# EAGLE design cpld_demo_board (EAGLE 5.07)
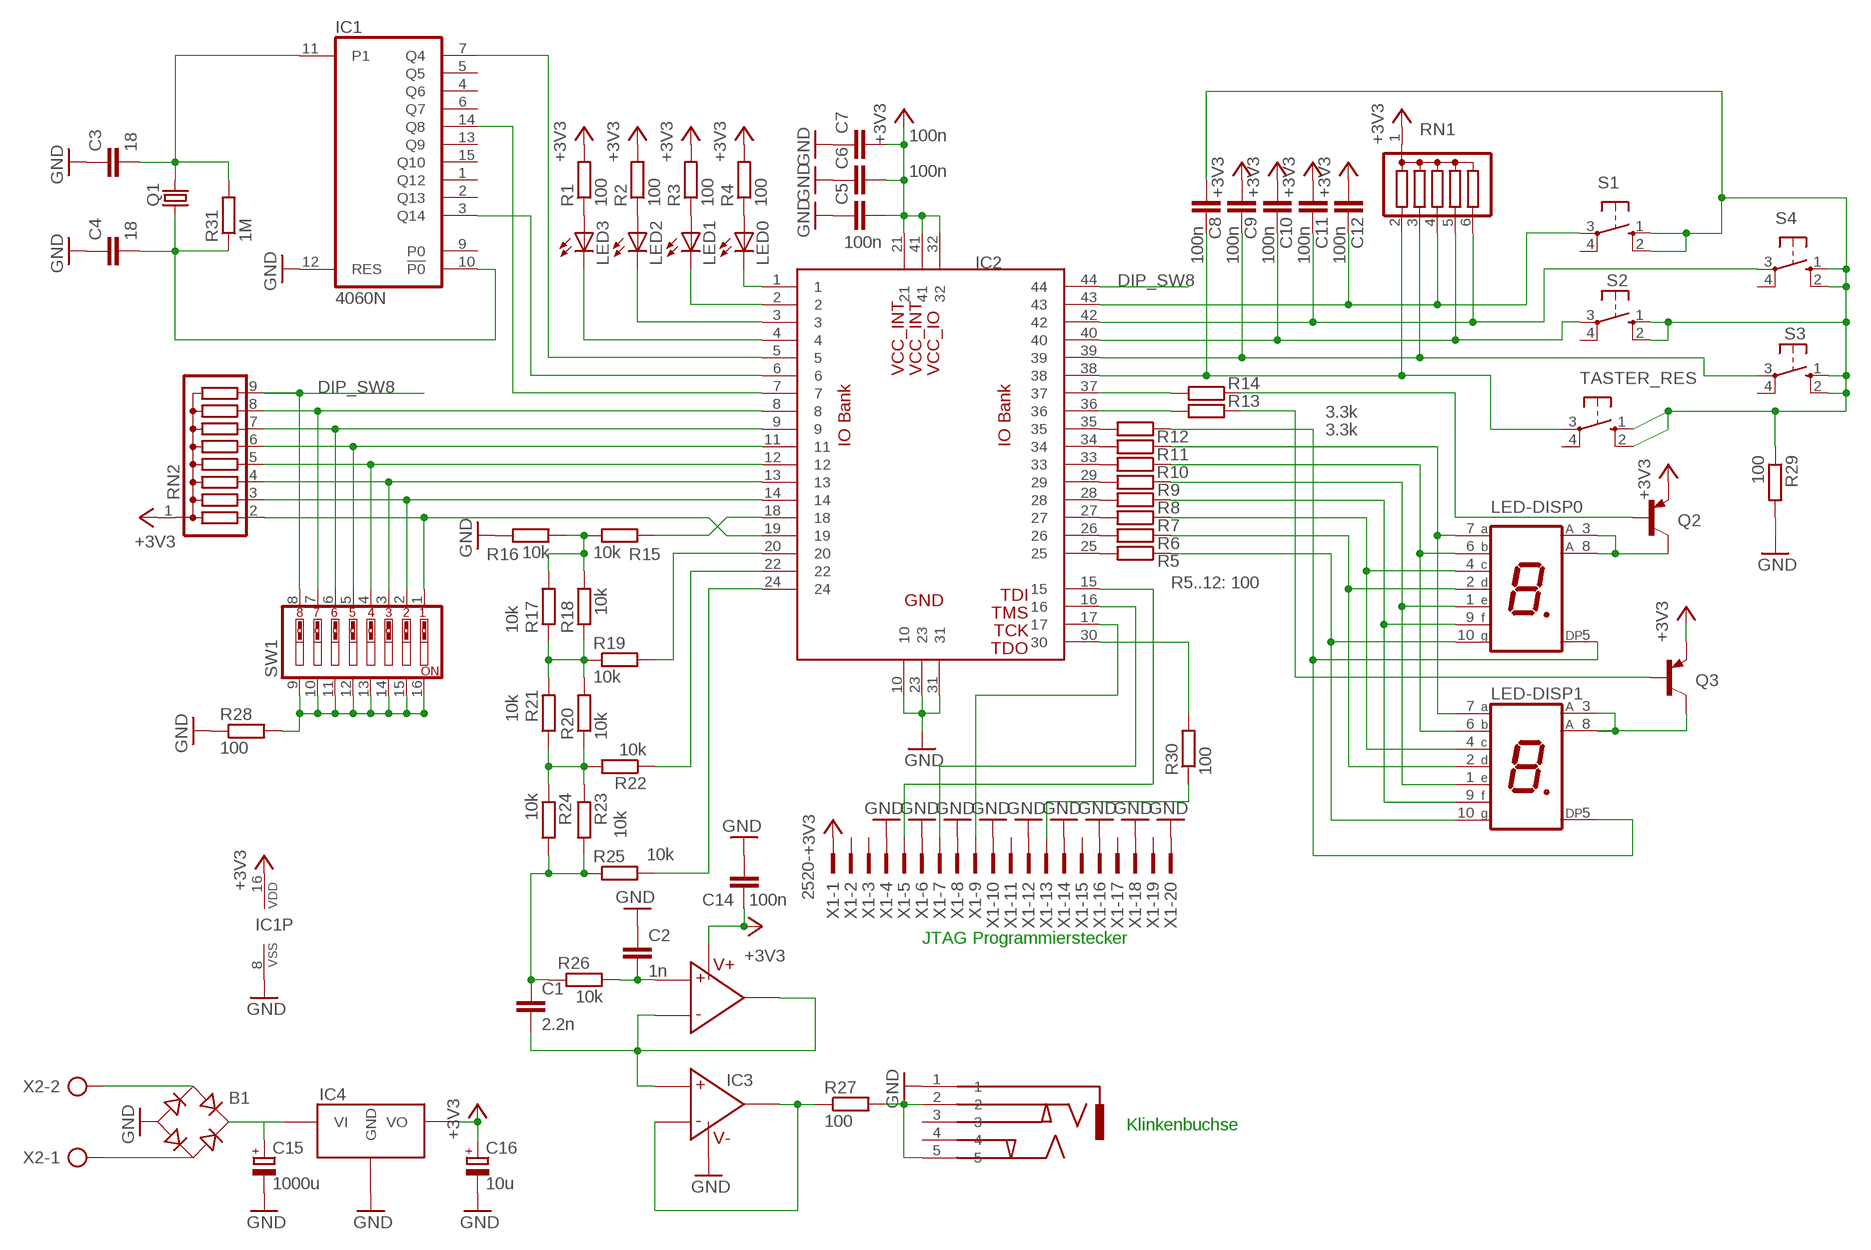
[diagram p0: schematic, sheet 1]

## Parts
B1  RB1A  [RB1A]
C1  2.2n  C2,5-3  [C2.5-3]
C2  1n  C2,5-3  [C2.5-3]
C3  18  C-EU025-024X044  [C025-024X044]
C4  18  C-EU025-024X044  [C025-024X044]
C5  100n  C-EU025-025X050  [C025-025X050]
C6  100n  C-EU025-025X050  [C025-025X050]
C7  100n  C-EU025-025X050  [C025-025X050]
C8  100n  C-EU025-025X050  [C025-025X050]
C9  100n  C-EU025-025X050  [C025-025X050]
C10  100n  C-EU025-025X050  [C025-025X050]
C11  100n  C-EU025-025X050  [C025-025X050]
C12  100n  C-EU025-025X050  [C025-025X050]
C14  100n  C-EU025-025X050  [C025-025X050]
C15  1000u  CPOL-EUE5-10.5  [E5-10,5]
C16  10u  CPOL-EUE2-5  [E2-5]
IC1  4060N  [DIL16]
IC2  XC9572XL  [PLCC44]
IC3  TS912  [DIP8]
IC4  LM2937ET-3.3  [TO220]
LED0  LED3MM  [LED3MM]
LED1  LED3MM  [LED3MM]
LED2  LED3MM  [LED3MM]
LED3  LED3MM  [LED3MM]
LED-DISP0  7-SEG_SA56-11  [SA56-11]
LED-DISP1  7-SEG_SA56-11  [SA56-11]
Q1  CRYSTALHC49U-V  [HC49U-V]
Q2  BC327PINS-IN-LINE  [TO92-]
Q3  BC327  BC327PINS-IN-LINE  [TO92-]
R1  100  R-EU_0207/10  [0207/10]
R2  100  R-EU_0207/10  [0207/10]
R3  100  R-EU_0207/10  [0207/10]
R4  100  R-EU_0207/10  [0207/10]
R5  R-EU_0207/10  [0207/10]
R6  R-EU_0207/10  [0207/10]
R7  R-EU_0207/10  [0207/10]
R8  R-EU_0207/10  [0207/10]
R9  R-EU_0207/10  [0207/10]
R10  R-EU_0207/10  [0207/10]
R11  R-EU_0207/10  [0207/10]
R12  R-EU_0207/10  [0207/10]
R13  3.3k  R-EU_0207/10  [0207/10]
R14  3.3k  R-EU_0207/10  [0207/10]
R15  10k  R-EU_0207/10  [0207/10]
R16  10k  R-EU_0207/10  [0207/10]
R17  10k  R-EU_0207/10  [0207/10]
R18  10k  R-EU_0207/10  [0207/10]
R19  10k  R-EU_0207/10  [0207/10]
R20  10k  R-EU_0207/10  [0207/10]
R21  10k  R-EU_0207/10  [0207/10]
R22  10k  R-EU_0207/10  [0207/10]
R23  10k  R-EU_0207/10  [0207/10]
R24  10k  R-EU_0207/10  [0207/10]
R25  10k  R-EU_0207/10  [0207/10]
R26  10k  R-EU_0207/10  [0207/10]
R27  100  R-EU_0207/10  [0207/10]
R28  100  R-EU_0207/10  [0207/10]
R29  100  R-EU_0207/10  [0207/10]
R30  100  R-EU_0207/10  [0207/10]
R31  1M  R-EU_0207/10  [0207/10]
RN1  G05R  [SIL6]
RN2  G08R  [SIL9]
S1  10-XX  [B3F-10XX]
S2  10-XX  [B3F-10XX]
S3  10-XX  [B3F-10XX]
S4  10-XX  [B3F-10XX]
SW1  SW_DIP-8  [EDG-08]
TASTER_RES  10-XX  [B3F-10XX]
X1  2520-  [PAK100/2500-20]
X2  AK500/2-H  [AK500/2-H]
X3  KLINKENBUCHSE  [KLINKENBUCHSE]

## Nets
+3V3: C5.2 C6.2 C9.2 C10.2 C11.2 C12.2 C14.1 C16.+ IC1.16(VDD) IC2.21 IC2.32 IC2.41 IC3.P$8 IC4.P$3(VO) Q2.1(E) Q3.1(E) R1.2 R2.2 R3.2 R4.2 RN1.1 RN2.1 X1.1
DIP_SW8: IC2.44 RN2.9 SW1.8
GND: B1.- C2.1 C3.1 C4.1 C5.1 C6.1 C7.1 C14.2 C15.- C16.- IC1.8(VSS) IC1.12(RES) IC2.10 IC2.23 IC2.31 IC3.P$4 IC4.P$2(GND) R16.1 R28.1 R29.2 X1.4 X1.6 X1.8 X1.10 X1.12 X1.14 X1.16 X1.18 X1.20 X3.1
N$1: LED3.A R1.1
N$2: LED2.A R2.1
N$3: LED1.A R3.1
N$4: LED0.A R4.1
N$5: IC2.25 R5.2
N$6: IC2.26 R6.2
N$7: IC2.27 R7.2
N$8: IC2.28 R8.2
N$9: IC2.29 R9.2
N$10: IC2.33 R10.2
N$11: IC2.34 R11.2
N$12: IC2.35 R12.2
N$13: LED-DISP1.3(A) LED-DISP1.8(A) Q3.3(C)
N$14: IC2.1 LED0.K(C)
N$15: IC2.2 LED1.K(C)
N$16: IC2.3 LED2.K(C)
N$17: IC2.4 LED3.K(C)
N$18: IC1.7(Q4) IC2.5
N$19: IC1.3(Q14) IC2.6
N$20: IC1.14(Q8) IC2.7
N$21: C4.2 IC1.10(!P0) Q1.1 R31.1
N$22: C3.2 IC1.11(P1) Q1.2 R31.2
N$23: IC2.18 R15.2
N$24: IC2.20 R19.2
N$25: IC2.22 R22.1
N$26: IC2.24 R25.2
N$27: R15.1 R16.2 R17.2 R18.2
N$28: IC2.14 RN2.3 SW1.2
N$29: R17.1 R18.1 R19.1 R20.2 R21.2
N$30: IC2.13 RN2.4 SW1.3
N$31: R20.1 R21.1 R22.2 R23.1 R24.1
N$32: C1.1 R23.2 R24.2 R25.1 R26.1
N$33: IC2.12 RN2.5 SW1.4
N$34: IC2.11 RN2.6 SW1.5
N$35: C2.2 IC3.P$3 R26.2
N$36: C1.2 IC3.P$1 IC3.P$2 IC3.P$5
N$37: IC3.P$6 IC3.P$7 R27.1
N$38: B1.AC1 X2.2
N$39: B1.AC2 X2.1
N$40: B1.+ C15.+ IC4.P$1(VI)
N$41: LED-DISP0.3(A) LED-DISP0.8(A) Q2.3(C)
N$42: LED-DISP0.7(A) LED-DISP1.7(A) R11.1
N$43: R28.2 SW1.9 SW1.10 SW1.11 SW1.12 SW1.13 SW1.14 SW1.15 SW1.16
N$44: IC2.19 RN2.2 SW1.1
N$45: IC2.9 RN2.7 SW1.6
N$46: IC2.8 RN2.8 SW1.7
N$47: IC2.17 X1.9
N$48: IC2.16 X1.7
N$49: IC2.15 X1.5
N$50: IC2.30 R30.2
N$51: R30.1 X1.13
N$52: R27.2 X3.2 X3.5
N$53: LED-DISP0.6(B) LED-DISP1.6(B) R10.1
N$54: LED-DISP0.1(E) LED-DISP1.1(E) R9.1
N$55: LED-DISP0.9(F) LED-DISP1.9(F) R8.1
N$56: LED-DISP0.4(C) LED-DISP1.4(C) R7.1
N$57: LED-DISP0.2(D) LED-DISP1.2(D) R6.1
N$58: LED-DISP0.10(G) LED-DISP1.10(G) R5.1
N$59: LED-DISP0.5(DP) LED-DISP1.5(DP) R12.1
N$60: C11.1 IC2.42 RN1.6 S4.3(P)
N$61: Q2.2(B) R14.1
N$62: IC2.37 R14.2
N$63: IC2.36 R13.2
N$64: Q3.2(B) R13.1
N$65: C12.1 IC2.43 RN1.4 S1.3(P)
N$66: C10.1 IC2.40 RN1.5 S2.3(P)
N$67: C9.1 IC2.39 RN1.3 S3.3(P)
N$68: C8.1 IC2.38 RN1.2 TASTER_RES.3(P)
N$69: C7.2
N$72: C8.2 R29.1 S1.1(S) S1.2(S1) S2.1(S) S2.2(S1) S3.1(S) S3.2(S1) S4.1(S) S4.2(S1) TASTER_RES.1(S) TASTER_RES.2(S1)
Unconnected: IC1.1(Q12) IC1.2(Q13) IC1.4(Q6) IC1.5(Q5) IC1.6(Q7) IC1.9(P0) IC1.13(Q9) IC1.15(Q10) S1.4(P1) S2.4(P1) S3.4(P1) S4.4(P1) TASTER_RES.4(P1) X1.2 X1.3 X1.11 X1.15 X1.17 X1.19 X3.3 X3.4

## Notes on the sheet
- R5..12: 100
- JTAG Programmierstecker
- Klinkenbuchse

## Library data of the parts
B1 = rectifier:RB1A: RECTIFIER 1 A
C1 C2 = capacitor-wima:C: CAPACITOR naming: grid - package width
C3-C12 C14 = rcl:C-EU: CAPACITOR, European symbol
C15 C16 = rcl:CPOL-EU: POLARIZED CAPACITOR, European symbol
IC1 = 40xx:4060: 14-stage binary/ripple COUNTER
IC2 = bastli:XC9572XL
IC3 = bastli:TS912
IC4 = bastli:LM2937ET-3.3
LED0 LED1-LED3 = led:LED: LED OSRAM: - CHIPLED LG R971, LG N971, LY N971, LG Q971, LY Q971, LO R971, LY R971 LH N974, LH R974 LS Q976, LO Q976, LY Q976 LO Q996 - Hyper CHIPLED LW Q18S LB Q993, LB Q99A, LB R99A - SideLED LS A670, LO A670, LY A670, LG A670, LP A670 LB A673, LV A673, LT A673, LW A673 LH A674 LY A675 LS A676, LA A676, LO A676, LY A676, LW A676 LS A679, LY A679, LG A679 - Hyper Micro SIDELED® LS Y876, LA Y876, LO Y876, LY Y876 LT Y87S - SmartLED LW L88C, LW L88S LB L89C, LB L89S, LG L890 LS L89K, LO L89K, LY L89K LS L896, LA L896, LO L896, LY L896 - TOPLED LS T670, LO T670, LY T670, LG T670, LP T670 LSG T670, LSP T670, LSY T670, LOP T670, LYG T670 LG T671, LOG T671, LSG T671 LB T673, LV T673, LT T673, LW T673 LH T674 LS T676, LA T676, LO T676, LY T676, LB T676, LH T676, LSB T676, LW T676 LB T67C, LV T67C, LT T67C, LS T67K, LO T67K, LY T67K, LW E67C LS E67B, LA E67B, LO E67B, LY E67B, LB E67C, LV E67C, LT E67C LW T67C LS T679, LY T679, LG T679 LS T770, LO T770, LY T770, LG T770, LP T770 LB T773, LV T773, LT T773, LW T773 LH T774 LS E675, LA E675, LY E675, LS T675 LS T776, LA T776, LO T776, LY T776, LB T776 LHGB T686 LT T68C, LB T68C - Hyper Mini TOPLED® LB M676 - Mini TOPLED Santana® LG M470 LS M47K, LO M47K, LY M47K Source: http://www.osram.convergy.de LUXEON: - LUMILED® LXK2-PW12-R00, LXK2-PW12-S00, LXK2-PW14-U00, LXK2-PW14-V00 LXK2-PM12-R00, LXK2-PM12-S00, LXK2-PM14-U00 LXK2-PE12-Q00, LXK2-PE12-R00, LXK2-PE12-S00, LXK2-PE14-T00, LXK2-PE14-U00 LXK2-PB12-K00, LXK2-PB12-L00, LXK2-PB12-M00, LXK2-PB14-N00, LXK2-PB14-P00, LXK2-PB14-Q00 LXK2-PR12-L00, LXK2-PR12-M00, LXK2-PR14-Q00, LXK2-PR14-R00 LXK2-PD12-Q00, LXK2-PD12-R00, LXK2-PD12-S00 LXK2-PH12-R00, LXK2-PH12-S00 LXK2-PL12-P00, LXK2-PL12-Q00, LXK2-PL12-R00 Source: www.luxeon.com KINGBRIGHT: KA-3528ASYC Source: www.kingbright.com
LED-DISP0 LED-DISP1 = display-kingbright:7-SEG_: Kingbright 14.2mm (0.56 INCH) SINGLE DIGIT NUMERIC DUISPLAY Source: SA56-11EWA(Ver1189471036.pdf
Q1 = crystal:CRYSTAL: CRYSTAL
Q2 Q3 = transistor-pnp:BC327: PNP Transistor
R1-R14 R31 = resistor:R-EU_: RESISTOR, European symbol
R15-R30 = rcl:R-EU_: RESISTOR, European symbol
RN1 = resistor-sil:G05R: SIL RESISTOR
RN2 = resistor-sil:G08R: SIL RESISTOR
S1-S4 TASTER_RES = switch-omron:10-XX: OMRON SWITCH
SW1 = special:SW_DIP-8: DIP SWITCH
X1 = con-3m:2520-: 3M (TM) Pak 100 4-Wall Header Source: 3M
X2 = con-ptr500:AK500/2-H: CONNECTOR Aug. 2004 / PTR Meßtechnik: Die Bezeichnung der Serie AK505 wurde geändert. Es handelt sich hierbei um AK500 in horizontaler Ausführung.
X3 = bastli:KLINKENBUCHSE

## Board
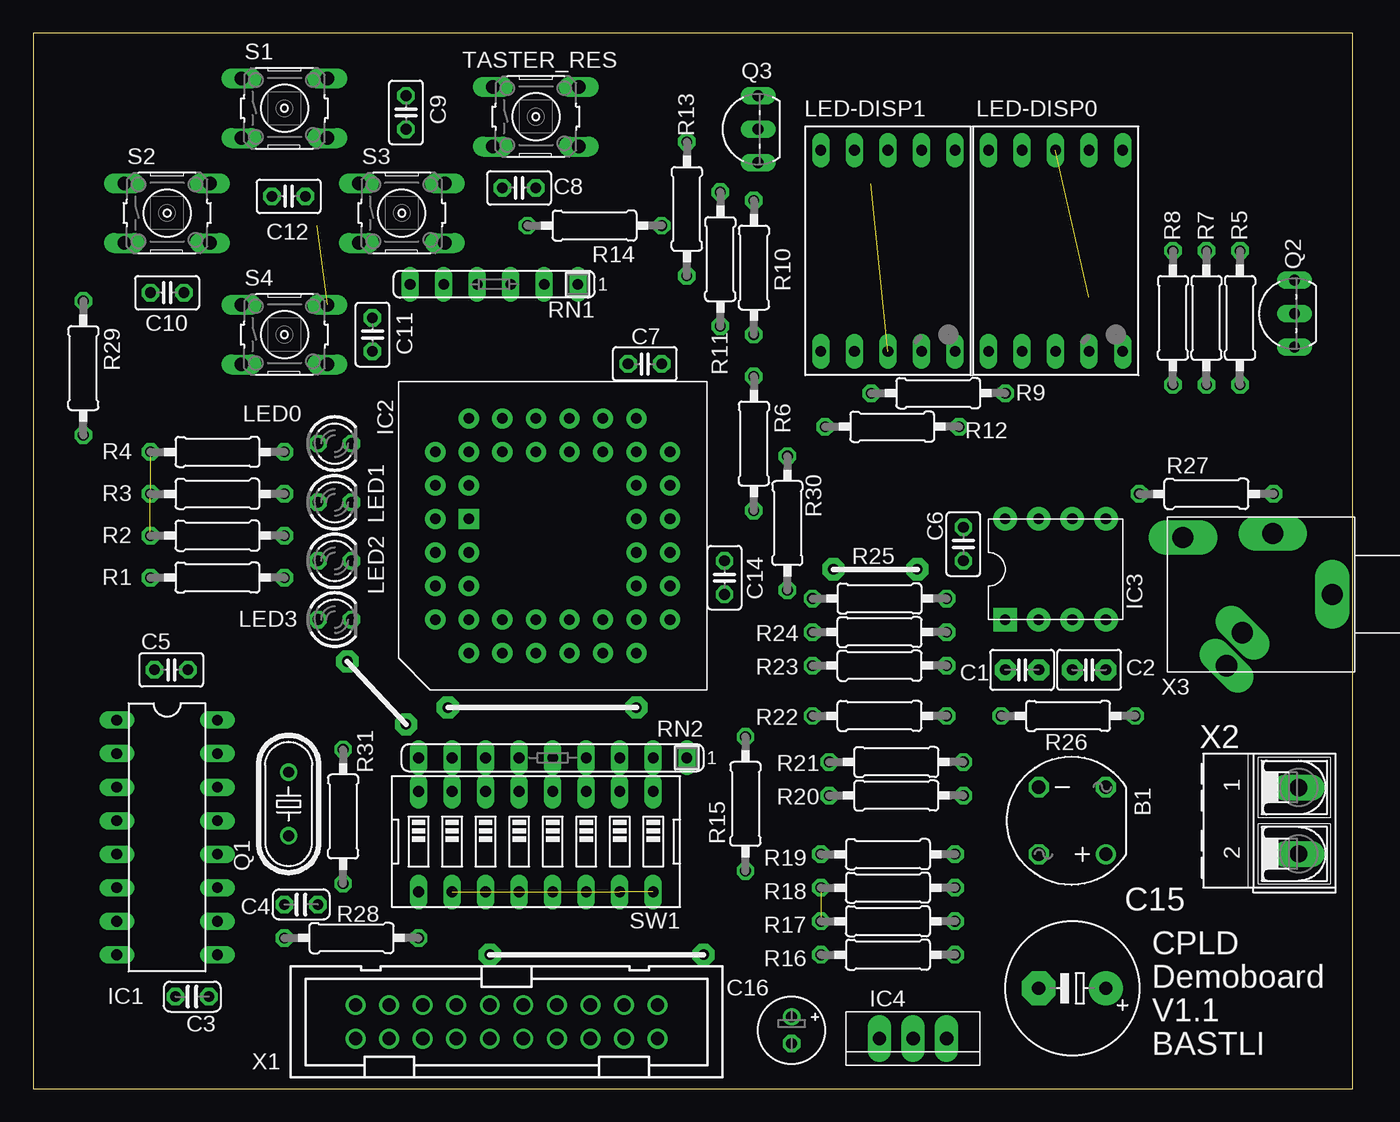
[diagram p1: board, top side]
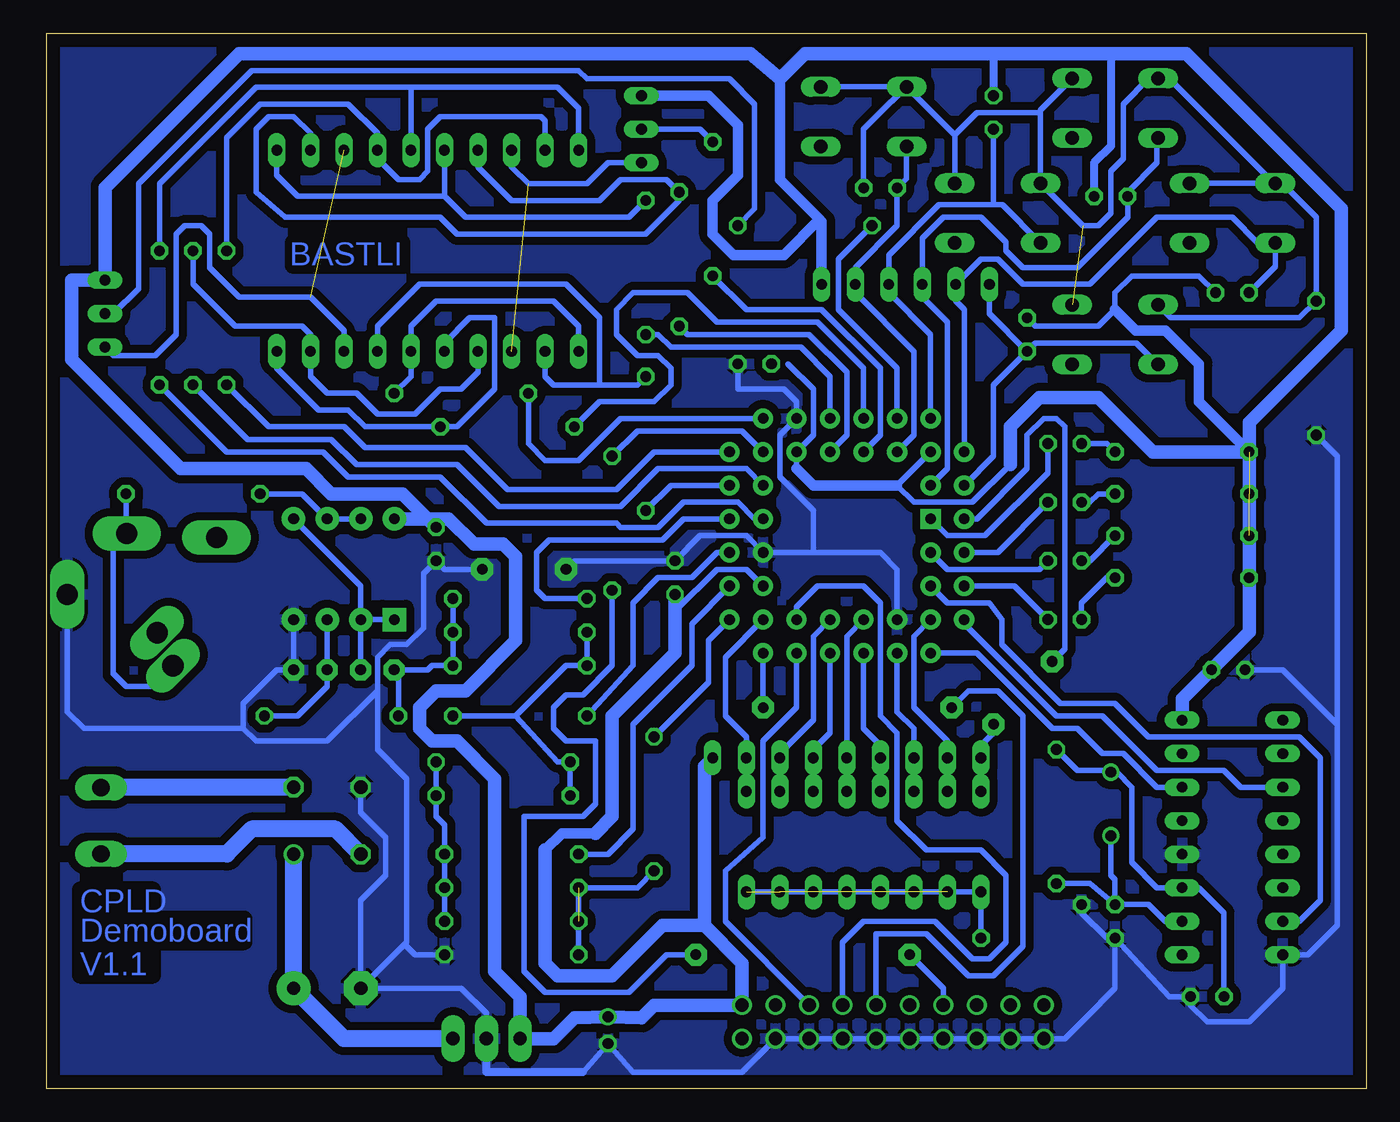
[diagram p2: board, bottom side, seen from below]

Size 100 x 80 mm. Coordinates in mm from the lower left corner, seen from the top.
Outline: 0,0 100,0 100,80 0,80 0,0
Copper layers (1*16): Top 0.035mm / dielectric 1.5mm / Bottom 0.035mm
Design rules "default": minimum track width 10mil, minimum drill 24mil, track to track 8mil, track to pad 8mil, pad to pad 8mil, via to via 8mil, smd to smd 8mil, copper to edge 40mil, drill to drill 8mil, minimum pad ring 10mil, minimum via ring 8mil, stop-mask expansion 4mil, vias tented up to drill 0mil, thermal gap 10mil

### Footprints (pad centres in the part's own frame; a part is rotated, then mirrored left to right if it is on the bottom)
RB1A = drill 1.016 round: + -2.54,2.54 | drill 1.016 octagon: - 2.54,-2.54; AC1 2.54,2.54; AC2 -2.54,-2.54
C2.5-3 = drill 0.813 pad 1.6 octagon: 1 -1.27,0; 2 1.27,0
C025-024X044 = drill 0.813 octagon: 1 -1.27,0; 2 1.27,0
C025-025X050 = drill 0.813 octagon: 1 -1.27,0; 2 1.27,0
E5-10,5 = drill 1.016 pad 2.54 round: + -2.54,0 | drill 1.016 pad 2.54 octagon: - 2.54,0
E2-5 = drill 0.813 pad 1.27 round: + -1.016,0 | drill 0.813 pad 1.27 octagon: - 1.016,0
DIL16 = drill 0.813 long: 1 -8.89,-3.81; 2 -6.35,-3.81; 3 -3.81,-3.81; 4 -1.27,-3.81; 5 1.27,-3.81; 6 3.81,-3.81; 7 6.35,-3.81; 8 8.89,-3.81; 9 8.89,3.81; 10 6.35,3.81; 11 3.81,3.81; 12 1.27,3.81; 13 -1.27,3.81; 14 -3.81,3.81; 15 -6.35,3.81; 16 -8.89,3.81
PLCC44 = drill 0.8 pad 1.524 square: 1 0,0 | drill 0.8 pad 1.524 round: 2 -2.54,-2.54; 3 0,-2.54; 4 -2.54,-5.08; 5 0,-5.08; 6 -2.54,-7.62; 7 0,-10.16; 8 0,-7.62; 9 2.54,-10.16; 10 2.54,-7.62; 11 5.08,-10.16; 12 5.08,-7.62; 13 7.62,-10.16; 14 7.62,-7.62; 15 10.16,-10.16; 16 10.16,-7.62; 17 12.7,-10.16; 18 15.24,-7.62; 19 12.7,-7.62; 20 15.24,-5.08; 21 12.7,-5.08; 22 15.24,-2.54; 23 12.7,-2.54; 24 15.24,0; 25 12.7,0; 26 15.24,2.54; 27 12.7,2.54; 28 15.24,5.08; 29 12.7,7.62; 30 12.7,5.08; 31 10.16,7.62; 32 10.16,5.08; 33 7.62,7.62; 34 7.62,5.08; 35 5.08,7.62; 36 5.08,5.08; 37 2.54,7.62; 38 2.54,5.08; 39 0,7.62; 40 -2.54,5.08; 41 0,5.08; 42 -2.54,2.54; 43 0,2.54; 44 -2.54,0
DIP8 = drill 0.8 pad 1.778 square: P$1 0,0 | drill 0.8 pad 1.778 round: P$2 0,-2.54; P$3 0,-5.08; P$4 0,-7.62; P$5 7.62,-7.62; P$6 7.62,-5.08; P$7 7.62,-2.54; P$8 7.62,0
TO220 = drill 1 pad 1.778 long: P$1 2.54,0; P$2 0,0; P$3 -2.54,0
LED3MM = drill 0.813 octagon: A -1.27,0; K 1.27,0
SA56-11 = drill 0.8 long: 1 -5.08,-7.62; 2 -2.54,-7.62; 3 0,-7.62; 4 2.54,-7.62; 5 5.08,-7.62; 6 5.08,7.62; 7 2.54,7.62; 8 0,7.62; 9 -2.54,7.62; 10 -5.08,7.62
HC49U-V = drill 0.813 round: 1 -2.413,0; 2 2.413,0
TO92- = drill 0.813 long: 1 2.54,-1.27; 2 0,-1.27; 3 -2.54,-1.27
0207/10 = drill 0.813 octagon: 1 -5.08,0; 2 5.08,0
SIL6 = drill 0.813 long: 1 -6.35,0; 2 -3.81,0; 3 -1.27,0; 4 1.27,0; 5 3.81,0; 6 6.35,0
SIL9 = drill 0.813 long: 1 -10.16,0; 2 -7.62,0; 3 -5.08,0; 4 -2.54,0; 5 0,0; 6 2.54,0; 7 5.08,0; 8 7.62,0; 9 10.16,0
B3F-10XX = drill 1.016 long: 1 -3.251,2.261; 2 3.251,2.261; 3 -3.251,-2.261; 4 3.251,-2.261
EDG-08 = drill 0.813 long: 1 -8.89,-3.81; 2 -6.35,-3.81; 3 -3.81,-3.81; 4 -1.27,-3.81; 5 1.27,-3.81; 6 3.81,-3.81; 7 6.35,-3.81; 8 8.89,-3.81; 9 8.89,3.81; 10 6.35,3.81; 11 3.81,3.81; 12 1.27,3.81; 13 -1.27,3.81; 14 -3.81,3.81; 15 -6.35,3.81; 16 -8.89,3.81
PAK100/2500-20 = drill 1 pad 1.422 round: 1 -11.43,-1.27; 2 -11.43,1.27; 3 -8.89,-1.27; 4 -8.89,1.27; 5 -6.35,-1.27; 6 -6.35,1.27; 7 -3.81,-1.27; 8 -3.81,1.27; 9 -1.27,-1.27; 10 -1.27,1.27; 11 1.27,-1.27; 12 1.27,1.27; 13 3.81,-1.27; 14 3.81,1.27; 15 6.35,-1.27; 16 6.35,1.27; 17 8.89,-1.27; 18 8.89,1.27; 19 11.43,-1.27; 20 11.43,1.27
AK500/2-H = drill 1.321 long: 1 -2.515,0; 2 2.515,0
KLINKENBUCHSE = drill 1.6 pad 2.6 long: 1 0,0; 4 11.303,-4.318; 5 4.5,-4.6 | drill 1.6 pad 2.3 long: 2 8,5.4; 3 6.8,2.9

### Placement (x,y rotation side)
B1  78.74,20.32 180 top
C1  74.93,31.75 0 top
C2  80.01,31.75 180 top
C3  12.06,6.99 180 top
C4  20.32,13.97 180 top
C5  10.48,31.75 0 top
C6  70.48,41.27 90 top
C7  46.35,54.93 180 top
C8  36.83,68.26 0 top
C9  28.26,73.98 90 top
C10  10.16,60.33 0 top
C11  25.72,57.15 90 top
C12  19.37,67.63 0 top
C14  52.39,38.73 90 top
C15  78.74,7.62 180 top
C16  57.47,4.45 270 top
IC1  10.16,19.05 270 top
IC2  33.02,43.18 0 top
IC3  73.66,35.56 90 top
IC4  66.67,3.81 0 top
LED0  22.86,48.9 0 top
LED1  22.86,44.45 0 top
LED2  22.86,40.01 0 top
LED3  22.86,35.56 0 top
LED-DISP0  77.47,63.5 0 top
LED-DISP1  64.77,63.5 0 top
Q1  19.37,21.59 90 top
Q2  94.3,58.74 90 top
Q3  53.66,72.71 90 top
R1  13.97,38.73 180 top
R2  13.97,41.91 180 top
R3  13.97,45.09 180 top
R4  13.97,48.26 180 top
R5  91.44,58.42 270 top
R6  54.61,48.9 270 top
R7  88.9,58.42 270 top
R8  86.36,58.42 270 top
R9  68.58,52.7 180 top
R10  54.61,62.23 270 top
R11  52.07,62.87 270 top
R12  65.09,50.16 180 top
R13  49.53,66.67 270 top
R14  42.55,65.41 180 top
R15  53.98,21.59 90 top
R16  64.77,10.16 180 top
R17  64.77,12.7 180 top
R18  64.77,15.24 180 top
R19  64.77,17.78 180 top
R20  65.41,22.23 0 top
R21  65.41,24.77 0 top
R22  64.14,28.26 0 top
R23  64.14,32.07 0 top
R24  64.14,34.61 0 top
R25  64.14,37.15 180 top
R26  78.42,28.26 0 top
R27  88.9,45.09 0 top
R28  24.13,11.43 0 top
R29  3.81,54.61 270 top
R30  57.15,42.86 90 top
R31  23.5,20.64 90 top
RN1  34.92,60.96 180 top
RN2  39.37,25.08 180 top
S1  19.05,74.3 0 top
S2  10.16,66.36 0 top
S3  27.94,66.36 0 top
S4  19.05,57.15 0 top
SW1  38.1,18.73 180 top
TASTER_RES  38.1,73.66 0 top
X1  35.88,5.08 180 top
X2  95.89,20.32 270 top
X3  98.42,37.47 180 top

### Tracks (layer width: path | path; a pad name or v marks a point on that pad's centre or on a via)
+3V3  (2 unrouted)
  Bottom 0.406: C14.1 52.39,36.2 49.21,39.37 46.99,39.37 IC2.21 | 43.81,54.93 41.91,53.02 41.91,49.53 IC2.32 43.18,46.99 | IC2.41 35.56,45.72 34.29,44.45 29.84,44.45 26.99,47.31 | C11.2 25.08,57.78 20.32,57.78 19.05,59.05 19.05,60.33 17.78,61.59 12.7,61.59 C10.2 | 41.43,65.88 41.27,65.72 | C6.2 70.48,43.18
  Bottom 0.61: C9.2 28.26,78.11 28.57,78.42 | C12.2 20.64,70.17 19.37,71.44 19.37,78.42
  Bottom 0.813: 43.18,46.99 41.91,45.72 35.56,45.72 | R4.2 12.7,52.07 12.7,54.93 15.24,57.47 17.46,57.47 19.05,59.05 | 44.45,76.52 44.45,68.9 41.43,65.88 44.13,63.18 47.94,63.18 49.53,64.77 49.53,67.31 47.62,69.22 47.62,73.03 49.85,75.25 Q3.1 | 41.27,65.72 RN1.1 | 58.42,19.37 60.96,19.37 62.23,18.1
  Bottom 1.016: R4.2 R1.2 8.89,34.61 C5.2 13.97,29.53 IC1.16 | R4.2 | 26.99,47.31 26.99,50.16 24.77,52.39 20.32,52.39 16.19,48.26 R4.2 | R4.2 8.89,50.48 1.91,57.47 1.91,66.67 13.65,78.42 19.37,78.42 28.57,78.42 42.55,78.42 44.45,76.52 46.67,78.42 85.41,78.42 95.57,68.26 Q2.1 98.11,61.28 98.11,55.24 89.85,46.99 80.33,46.99 78.42,45.09 73.03,45.09 C6.2 | 50.16,12.38 47.31,9.53 X1.1 53.98,6.35 54.93,5.4 C16.+ 60.01,5.4 61.59,3.81 IC4.P$3 64.14,6.99 66.04,8.89 66.04,23.5 68.9,26.35 70.8,26.35 71.75,27.3 71.75,28.89 70.48,30.16 68.26,30.16 64.45,33.97 64.45,40.32 65.41,41.27 67.63,41.27 69.53,43.18 70.48,43.18 IC3.P$8 | 50.16,12.38 50.16,24.45 RN2.1 | C14.1 52.39,33.02 57.15,28.26 57.15,20.64 58.42,19.37 | 62.23,18.1 62.23,9.53 61.28,8.57 57.15,8.57 53.34,12.38 50.16,12.38
DIP_SW8  (via drill 0.8 pad 1.68)
  Top 0.406: v28.26,27.62 v23.81,32.38
  Bottom 0.406: IC2.44 29.53,43.18 25.72,46.99 25.72,49.53 24.45,50.8 23.5,50.8 22.86,50.16 22.86,33.34 v23.81,32.38 | SW1.8 RN2.9 29.21,26.04 28.26,26.99 v28.26,27.62
GND  (via drill 0.8 pad 1.68)
  Top 0.406: v66.99,39.37 v60.64,39.37
  Bottom 0.406: IC3.P$4 C2.1 82.55,31.75 85.09,29.21 85.09,27.3 | 2.22,27.62 2.22,12.38 4.45,10.16 IC1.8 6.35,7.62 8.89,5.08 12.06,5.08 13.34,6.35 C3.1 14.92,6.99 R28.1 | 2.22,27.62 2.22,47.94 R29.2 | 41.91,40.64 IC2.23 46.99,41.91 50.48,41.91 C14.2 60.01,40.01 v60.64,39.37 | IC2.10 35.56,39.37 36.83,40.64 41.91,40.64 | 41.91,40.64 41.91,43.81 44.45,46.35 44.45,49.53 IC2.31 43.18,52.07 44.13,53.02 47.62,53.02 C7.1 | R28.1 19.05,7.62 21.27,5.4 22.86,3.81 X1.20 X1.4 47.31,1.27 55.56,1.27 C16.- 59.37,1.27 | R28.1 19.68,11.43 21.59,13.34 C4.1 | IC4.P$2 66.67,5.71 68.58,7.62 C15.- | X3.1 98.42,28.57 97.16,27.3 85.09,27.3 | C5.1 6.35,31.75 2.22,27.62 | v66.99,39.37 69.85,39.37 C6.1 71.44,39.05 71.44,34.92 72.71,33.66 73.98,33.66 74.93,32.7 74.93,30.16 | C15.- 76.2,14.29 74.3,16.19 74.3,19.05 76.2,20.95 B1.- | C15.- 72.87,10.95 | 72.87,10.95 72.71,11.11 72.71,23.5 74.93,25.72 74.93,30.16 | R16.1 72.07,10.16 72.87,10.95 | 85.09,27.3 84.14,26.35 78.74,26.35 74.93,30.16
  Bottom 0.61: IC4.P$2 66.67,1.27 59.37,1.27
  pour Bottom (isolate 0.61): 0.32,0.32 99.69,0.32 99.69,79.69 0.32,79.69
N$1
  Bottom 0.406: R1.1 19.68,38.73 21.59,36.83 LED3.A
N$2
  Bottom 0.406: LED2.A 20.95,40.01 R2.1
N$3
  Bottom 0.406: R3.1 20.32,45.09 20.95,44.45 LED1.A
N$4
  Bottom 0.406: LED0.A 19.68,48.9 R4.1
N$5
  Bottom 0.406: IC2.25 46.35,43.18 47.62,44.45 51.75,44.45 53.66,42.55 56.52,42.55 56.83,42.86 66.67,42.86 70.17,46.35 77.15,46.35 79.06,48.26 86.36,48.26 R5.2
N$6
  Bottom 0.406: R6.2 52.7,45.72 IC2.26
N$7
  Bottom 0.406: R7.2 84.77,49.21 78.42,49.21 76.52,47.31 68.9,47.31 65.72,44.13 56.52,44.13 53.66,46.99 46.99,46.99 IC2.27
N$8
  Bottom 0.406: IC2.28 53.98,48.26 56.83,45.4 65.09,45.4 68.26,48.58 75.88,48.58 77.47,50.16 83.19,50.16 R8.2
N$9
  Bottom 0.406: R9.2 63.5,48.9 62.23,47.62 59.69,47.62 56.52,50.8 IC2.29
N$10
  Bottom 0.406: R10.2 53.66,57.15 52.7,56.2 42.86,56.2 40.64,53.98 IC2.33
N$11
  Bottom 0.406: IC2.34 39.37,49.53 39.37,54.29 42.23,57.15 51.44,57.15 R11.2
N$12
  Bottom 0.406: R12.2 58.1,52.07 53.98,52.07 52.7,53.34 52.7,54.61 53.66,55.56 55.24,55.56 56.83,57.15 56.83,59.05 55.56,60.33 51.44,60.33 49.21,58.1 41.59,58.1 38.1,54.61 IC2.35
N$13  (1 unrouted)
  Bottom 0.406: Q3.3 57.47,70.17 59.05,68.58 63.5,68.58 64.77,69.85 LED-DISP1.8
N$14
  Bottom 0.406: IC2.1 31.75,41.91 28.89,41.91 24.13,46.67 LED0.K
N$15
  Bottom 0.406: IC2.2 27.94,40.64 LED1.K
N$16
  Bottom 0.406: LED2.K 24.77,39.37 31.75,39.37 IC2.3
N$17
  Bottom 0.406: IC2.4 26.67,38.1 LED3.K
N$18
  Bottom 0.406: IC1.7 5.08,12.7 3.49,14.29 3.49,25.08 5.08,26.67 16.51,26.67 19.05,29.21 23.18,29.21 27.62,33.66 27.62,35.56 28.57,36.83 31.75,36.83 IC2.5
N$19
  Bottom 0.406: IC2.6 30.48,35.24 29.84,34.61 23.5,28.26 20,28.26 15.88,24.13 10.79,24.13 9.53,22.86 IC1.3
N$20
  Bottom 0.406: IC1.14 15.88,22.86 18.41,25.4 20,25.4 21.91,27.3 23.81,27.3 29.53,33.02 IC2.7
N$21
  Bottom 0.406: C4.2 19.05,15.88 19.37,16.19 Q1.1 | C4.2 16.51,13.97 15.24,12.7 IC1.10 | R31.1 20.95,15.56 C4.2
N$22
  Bottom 0.406: C3.2 10.79,13.34 12.7,15.24 IC1.11 15.88,15.24 17.78,17.14 17.78,22.86 18.92,24 Q1.2 19.18,24.13 21.91,24.13 R31.2
N$23
  Bottom 0.406: R15.2 49.85,30.8 49.85,33.97 IC2.18
N$24
  Bottom 0.406: R19.2 57.47,17.78 55.56,19.68 55.56,27.62 51.12,32.07 51.12,35.24 IC2.20
N$25
  Bottom 0.406: R22.1 55.56,32.07 55.56,36.83 53.66,38.73 51.12,38.73 49.21,40.64 IC2.22
N$26
  Bottom 0.406: IC2.24 51.75,43.18 53.34,41.59 61.91,41.59 62.87,40.64 62.87,37.78 62.23,37.15 R25.2
N$27  (1 unrouted)
  Bottom 0.406: R16.2 R18.2 55.24,15.24 R15.1
N$28
  Bottom 0.406: IC2.14 41.91,34.29 41.91,27.94 44.45,25.4 RN2.3 SW1.2
N$29
  Bottom 0.406: R17.1 R18.1 R19.1 69.85,20 70.48,20.64 R20.2 R21.2
N$30
  Bottom 0.406: IC2.13 40.64,26.99 41.91,25.72 RN2.4 SW1.3
N$31
  Bottom 0.406: R20.1 R21.1 61.28,24.77 64.45,28.26 | 64.45,28.26 R22.2 | R24.1 R23.1 60.64,32.07 64.45,28.26
N$32
  Bottom 0.406: R26.1 73.34,31.75 | 73.34,31.75 71.12,31.75 70.8,32.07 R23.2 R24.2 R25.1 | 73.34,31.75 C1.1
N$33
  Bottom 0.406: IC2.12 39.37,34.29 RN2.5 SW1.4
N$34
  Bottom 0.406: IC2.11 38.1,27.3 36.83,26.04 RN2.6 SW1.5
N$35
  Bottom 0.406: IC3.P$3 C2.2 78.74,30.48 80.96,28.26 R26.2
N$36
  Bottom 0.406: C1.2 IC3.P$2 | IC3.P$2 IC3.P$1 | IC3.P$2 76.2,38.1 IC3.P$5
N$37
  Bottom 0.406: IC3.P$7 IC3.P$6 80.64,45.09 R27.1
N$38
  Bottom 1.27: B1.AC1 78.11,19.68 84.45,19.68 86.33,17.8 X2.2
N$39
  Bottom 0.406: 95.86,22.86 X2.1
  Bottom 1.27: B1.AC2 95.86,22.86
N$40
  Bottom 1.27: IC4.P$1 77.47,3.81 C15.+ B1.+
N$41  (1 unrouted)
  Bottom 0.406: Q2.3 94.93,55.56 91.76,55.56 90.17,57.15 90.17,64.77 89.53,65.41 88.27,65.41 87.63,64.77 87.63,62.23 85.41,60.01 80.01,60.01 77.47,57.47 LED-DISP0.3
N$42
  Bottom 0.406: LED-DISP1.7 67.31,69.85 64.77,67.31 58.1,67.31 56.52,68.9 53.02,68.9 R11.1 52.07,67.31 54.61,64.77 68.9,64.77 70.17,66.04 81.92,66.04 84.14,67.94 84.14,72.71 83.19,73.66 81.28,73.66 80.01,72.39 LED-DISP0.7
N$43  (6 unrouted)
  Bottom 0.406: SW1.16 SW1.9 R28.2
N$44
  Bottom 0.406: IC2.19 48.58,32.7 48.58,28.26 46.99,26.67 RN2.2 SW1.1
N$45
  Bottom 0.406: SW1.6 RN2.7 34.29,27.3 35.56,28.57 IC2.9
N$46
  Bottom 0.406: IC2.8 34.29,34.29 34.29,28.89 31.75,26.35 RN2.8 SW1.7
N$47  (via drill 0.8 pad 1.68)
  Top 0.406: v31.43,28.89 v45.72,28.89
  Bottom 0.406: v45.72,28.89 IC2.17 | X1.9 37.15,11.75 33.34,11.75 30.16,8.57 28.26,8.57 26.04,10.79 26.04,28.26 27.94,30.16 30.16,30.16 v31.43,28.89
N$48
  Bottom 0.406: IC2.16 43.18,36.51 41.59,38.1 38.1,38.1 36.83,36.83 36.83,28.26 35.56,26.99 35.56,20.32 33.34,18.1 29.21,18.1 27.3,16.19 27.3,11.11 28.57,9.84 29.84,9.84 32.7,12.7 38.1,12.7 39.69,11.11 X1.7
N$49
  Bottom 0.406: IC2.15 43.18,28.89 45.72,26.35 45.72,19.05 48.58,16.51 48.58,12.7 X1.5
N$50
  Bottom 0.406: IC2.30 47.31,49.85 55.24,49.85 R30.2
N$51  (via drill 0.8 pad 1.68)
  Top 0.406: v34.61,10.16 v50.8,10.16
  Bottom 0.406: R30.1 57.15,32.07 59.37,29.84 60.64,29.84 61.59,28.89 61.59,27.3 60.64,26.35 58.42,26.35 58.42,21.59 59.37,20.64 63.82,20.64 63.82,8.89 62.23,7.3 55.88,7.3 53.02,10.16 v50.8,10.16 | X1.13 32.07,7.62 v34.61,10.16
N$52
  Bottom 0.406: 94.92,31.44 94.93,31.43 | 94.92,31.44 94.93,31.44 94.93,40.96 X3.5 93.98,42.93 R27.2 | X3.2 91.44,30.48 93.98,30.48 93.98,30.5 94.92,31.44
N$53
  Bottom 0.406: R10.1 55.88,66.04 68.26,66.04 69.85,67.63 | 69.85,67.63 LED-DISP1.6 | LED-DISP0.6 82.55,69.22 80.96,67.63 69.85,67.63
N$54
  Bottom 0.406: LED-DISP1.1 59.69,57.78 61.59,59.69 70.48,59.69 72.39,57.78 LED-DISP0.1 72.39,53.98 R9.1
N$55
  Bottom 0.406: R8.1 86.36,72.07 83.82,74.61 77.15,74.61 74.93,72.39 LED-DISP0.9 74.93,70.48 73.34,68.9 71.75,68.9 71.12,69.53 71.12,72.71 70.17,73.66 62.55,73.66 62.23,73.34 LED-DISP1.9
N$56
  Bottom 0.406: R7.1 88.9,60.96 85.72,57.78 80.64,57.78 80.01,57.15 LED-DISP0.4 80.01,53.98 78.74,52.7 76.52,52.7 74.93,51.12 72.07,51.12 70.17,53.02 68.58,53.02 67.31,54.29 LED-DISP1.4
N$57
  Bottom 0.406: LED-DISP1.2 62.23,53.98 61.59,53.34 58.1,53.34 | 58.1,53.34 55.24,53.34 R6.1 | LED-DISP0.2 74.93,57.78 71.75,60.96 60.64,60.96 58.1,58.42 58.1,53.34
N$58
  Bottom 0.406: LED-DISP1.10 59.69,74.3 61.28,75.88 72.39,75.88 | 72.39,75.88 LED-DISP0.10 | R5.1 91.44,68.58 84.14,75.88 72.39,75.88
N$59
  Bottom 0.406: LED-DISP1.5 69.85,56.52 67.94,58.42 66.04,58.42 66.04,53.02 68.9,50.16 R12.1 75.88,50.16 77.15,51.44 79.38,51.44 82.55,54.61 LED-DISP0.5
N$60
  Bottom 0.406: IC2.42 28.26,47.94 28.26,53.34 C11.1 | S4.3 17.42,56.52 25.08,56.52 C11.1 | RN1.6 28.57,58.74 C11.1
N$61
  Bottom 0.406: R14.1 46.35,66.67 46.35,74.61 48.26,76.52 59.05,76.52 59.69,77.15 84.45,77.15 93.03,68.58 93.03,60.64 94.93,58.74 Q2.2
N$62
  Bottom 0.406: IC2.37 35.56,54.61 40.01,59.05 40.01,62.87 R14.2
N$63
  Bottom 0.406: IC2.36 36.83,49.53 36.83,54.61 41.27,59.05 46.99,59.05 R13.2
N$64
  Bottom 0.406: Q3.2 50.48,72.71 R13.1
N$65
  Bottom 0.406: IC2.43 31.75,46.99 31.75,58.1 33.66,60.01 RN1.4 33.66,64.45 32.07,66.04 29.21,66.04 27.3,64.14 27.3,63.5 26.04,62.23 21.91,62.23 18.1,66.04 C12.1 18.1,67.94 15.88,70.17 15.88,71.96 S1.3
N$66
  Bottom 0.406: C10.1 6.91,62.31 S2.3 8.22,64.1 10.16,66.04 15.88,66.04 20.95,60.96 26.04,60.96 27.94,62.87 29.21,62.87 RN1.5 31.11,59.69 30.48,59.05 IC2.40
N$67
  Bottom 0.406: 28.26,66.99 32.38,66.99 36.2,63.18 RN1.3 36.2,60.33 33.02,57.15 IC2.39 | 28.26,66.99 27.58,66.99 S3.3 | 28.26,66.99 C9.1
N$68
  Bottom 0.406: TASTER_RES.3 34.85,68.97 C8.1 35.56,65.41 38.73,62.23 RN1.2 38.73,60.33 34.29,55.88 34.29,49.53 IC2.38
N$72  (1 unrouted)
  Bottom 0.406: S2.1 6.39,68.62 3.81,66.04 R29.1 5.08,58.42 14.81,58.42 S4.1 | S2.1 6.91,68.5 14.92,76.52 15.84,76.52 | 15.84,76.52 S1.1 | TASTER_RES.1 31.19,72.26 S3.2 31.19,72.31 29.53,73.98 24.69,73.98 | C8.2 38.1,72.71 37.11,73.7 TASTER_RES.1 | 24.69,73.98 S3.1 21.48,65.41 20.32,65.41 19.37,66.36 19.37,69.53 18.41,70.48 18.41,74.61 16.51,76.52 15.84,76.52 | 24.69,73.98 24.69,74.17 S1.2 | S2.1 S2.2 | TASTER_RES.1 TASTER_RES.2

### Text on the board
Bottom: BASTLI | CPLD | Demoboard | V1.1
tPlace: CPLD | Demoboard | V1.1 | BASTLI